# Altium schematic sheet Circuit diagram source file.SchDoc
size A4
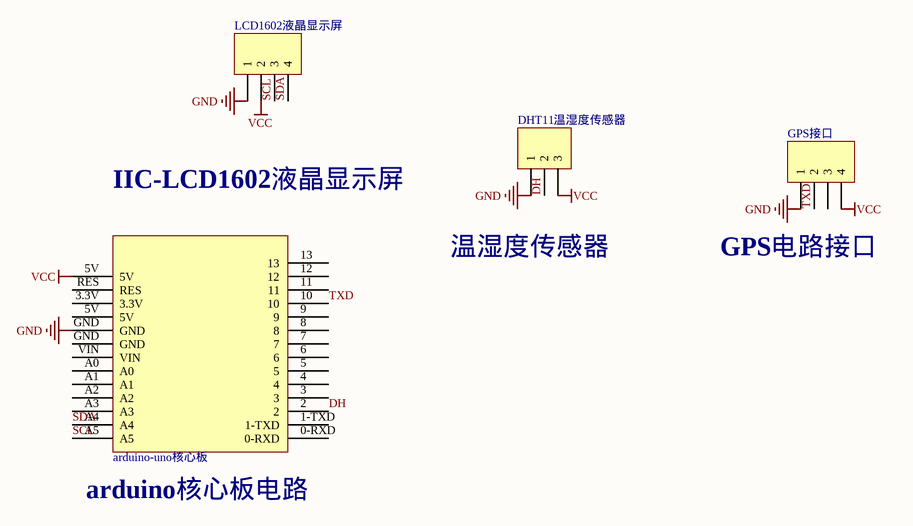
[diagram p0: Circuit diagram source file.SchDoc]

## Parts
arduino-uno核心板  Component_2  (value not drawn)
DHT11温湿度传感器  Header 3  [HDR1X3]  (value not drawn)
GPS接口  Header 4  [HDR1X4]  (value not drawn)
LCD1602液晶显示屏  Header 4  [HDR1X4]  (value not drawn)

## Nets
GND: arduino-uno核心板.GND DHT11温湿度传感器.1 GPS接口.1 LCD1602液晶显示屏.1
VCC: arduino-uno核心板.5V DHT11温湿度传感器.3 GPS接口.4 LCD1602液晶显示屏.2
DH: arduino-uno核心板.2 DHT11温湿度传感器.2
SCL: arduino-uno核心板.A5 LCD1602液晶显示屏.3
SDA: arduino-uno核心板.A4 LCD1602液晶显示屏.4
TXD: arduino-uno核心板.10 GPS接口.2

Not connected (* = marked no-connect by the designer): arduino-uno核心板 0-RXD 1-TXD 3 3.3V 4 5 6 7 8 9 11 12 13 A0 A1 A2 A3 RES VIN; GPS接口 3

## Notes on the sheet
- IIC-LCD1602液晶显示屏
- 温湿度传感器
- (near GPS接口) GPS电路接口
- (near arduino-uno核心板) arduino核心板电路

## Library data of the parts
DHT11温湿度传感器 = Header 3: Header, 3-Pin; LatestRevisionDate: 17-Jul-2002; LatestRevisionNote: Re-released for DXP Platform.; Publisher: Altium Limited
GPS接口 LCD1602液晶显示屏 = Header 4: Header, 4-Pin; LatestRevisionDate: 17-Jul-2002; LatestRevisionNote: Re-released for DXP Platform.; Publisher: Altium Limited